# Altium schematic sheet BW1097_SODIMM.SchDoc: =project_title
size Tabloid; CompanyName: Luxonis Holding; Organization: Luxonis Holding; Address1: 1925 Harmony Park Drive; Address2: Westminster, CO; Address3: 80234; Address4: United States; SheetNumber: 9; SheetTotal: 17
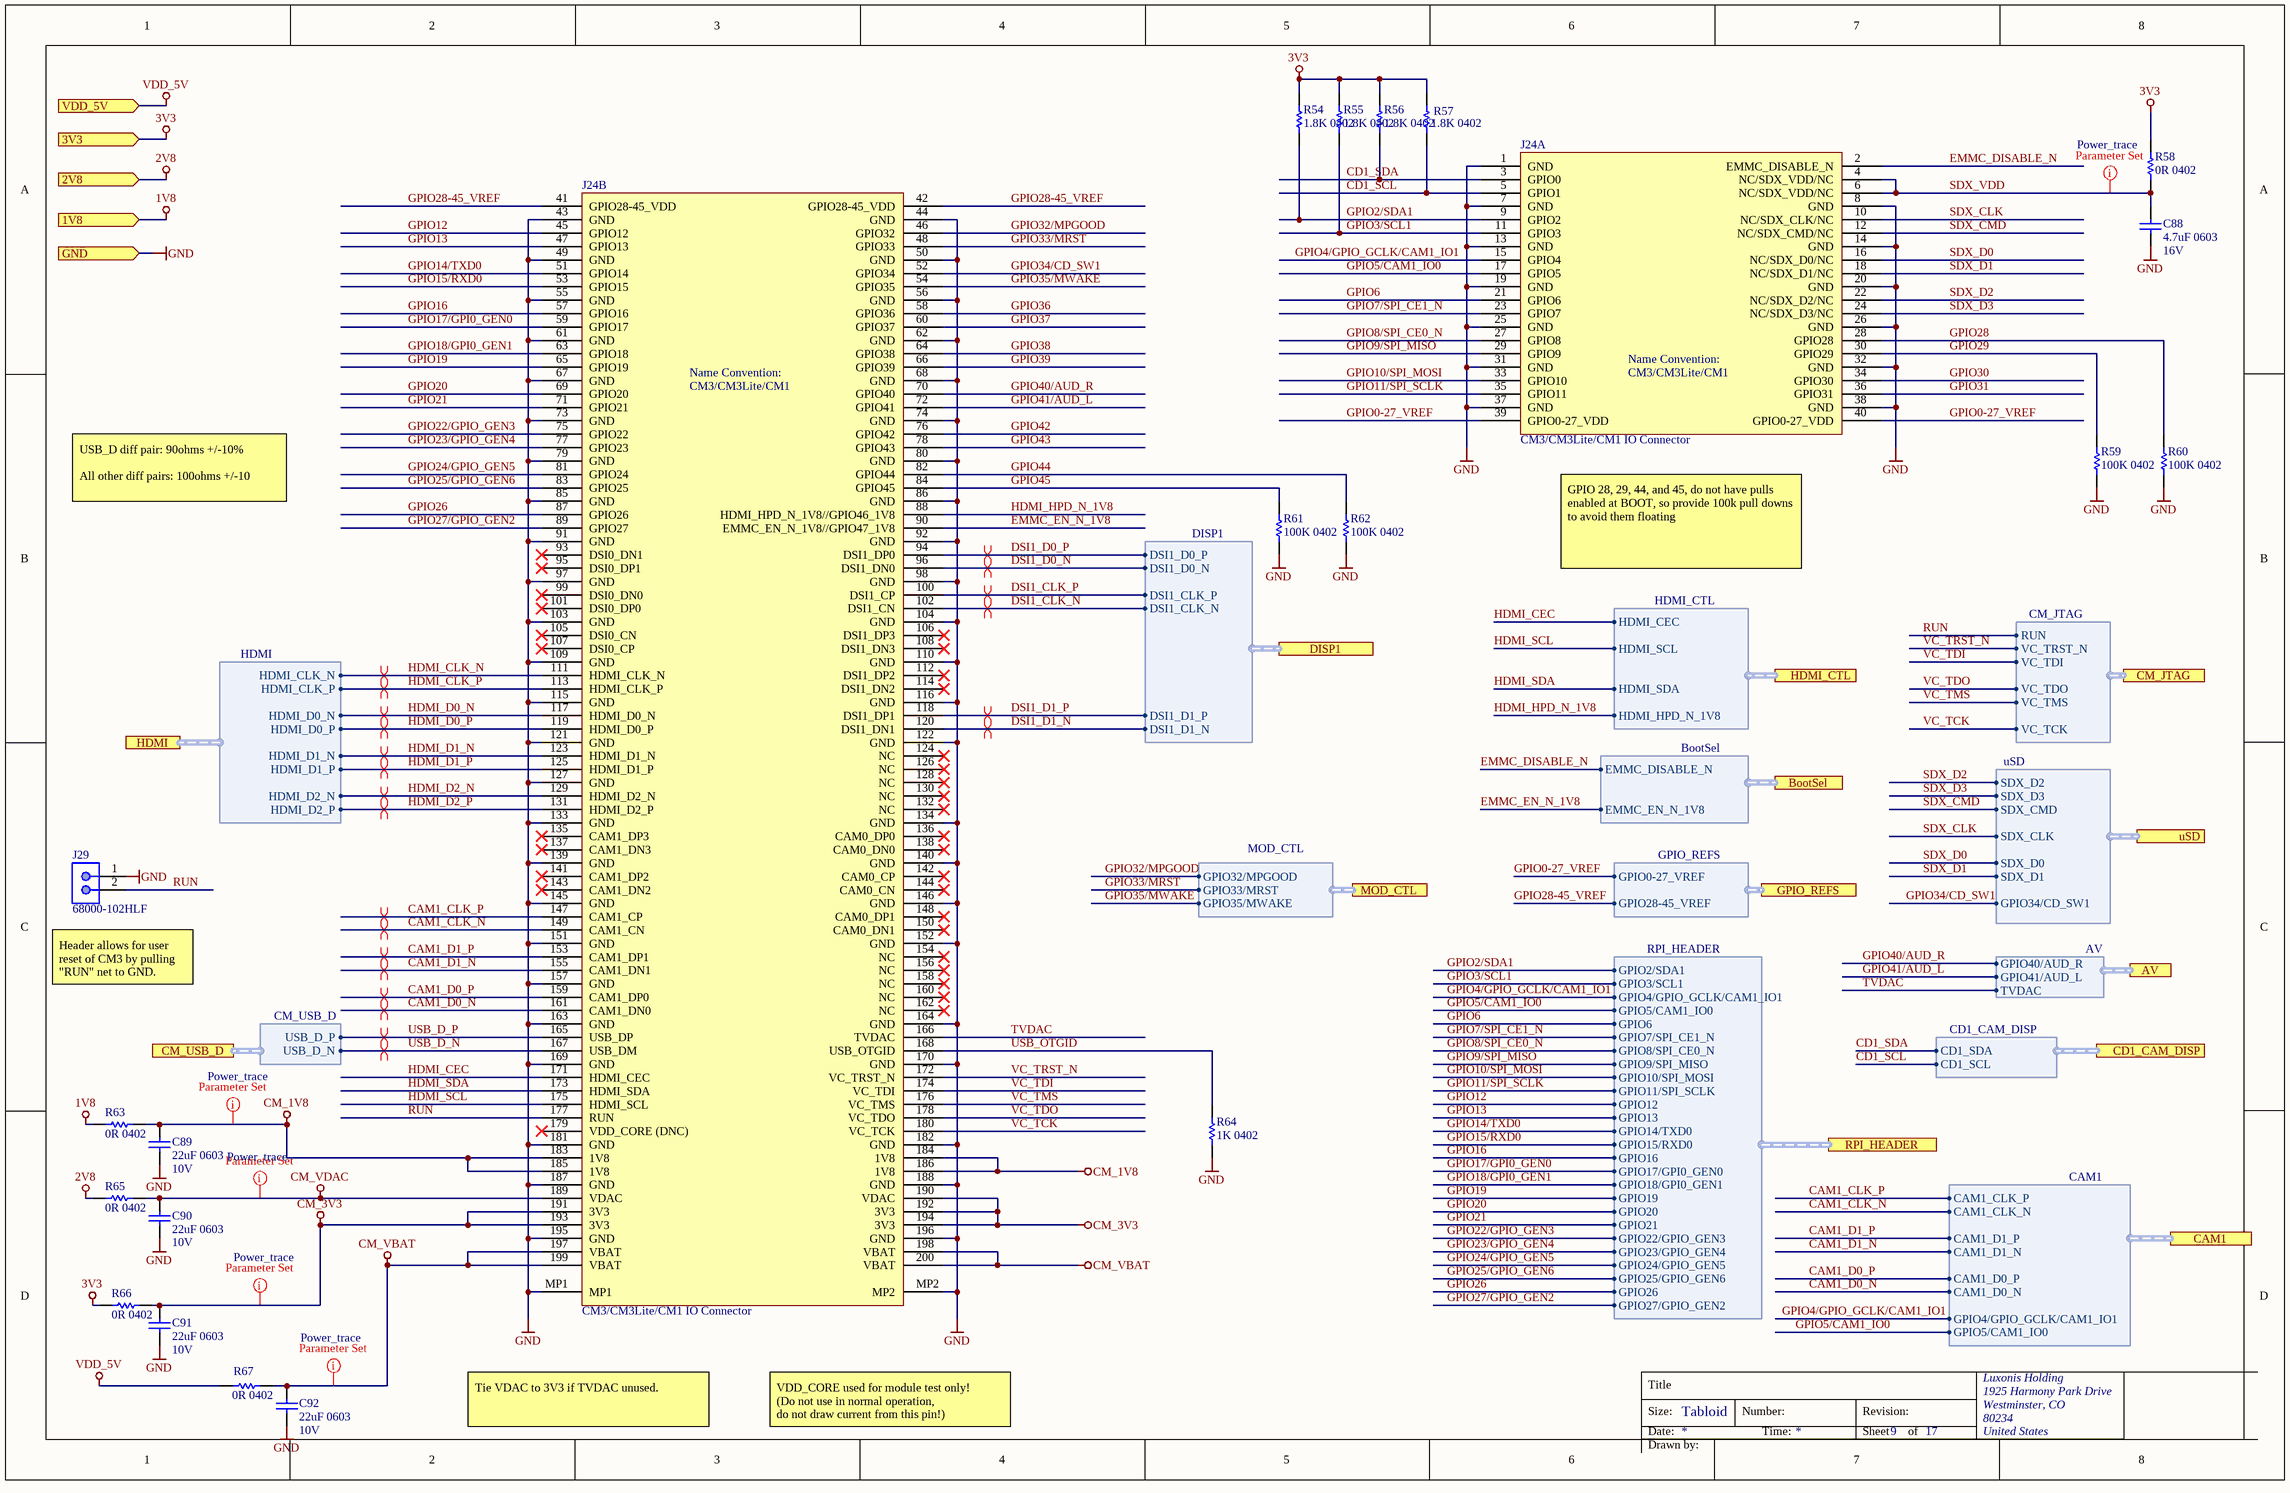
[diagram p0: BW1097_SODIMM.SchDoc]

## Parts
C88  4.7uF 0603  Voltage Rating: 16V  [CAPC0603(1608)100_N]
C89  22uF 0603  Voltage Rating: 10V  [CAPC0603(1608)100_N]
C90  22uF 0603  Voltage Rating: 10V  [CAPC0603(1608)100_N]
C91  22uF 0603  Voltage Rating: 10V  [CAPC0603(1608)100_N]
C92  22uF 0603  Voltage Rating: 10V  [CAPC0603(1608)100_N]
J24  CM3/CM3Lite/CM1 IO Connector  [1473005-4]  (parts A,B of 2)
J29  68000-102HLF  [68000-102HLF]
R54  1.8K 0402  [RESC0402(1005)_N]
R55  1.8K 0402  [RESC0402(1005)_N]
R56  1.8K 0402  [RESC0402(1005)_N]
R57  1.8K 0402  [RESC0402(1005)_N]
R58  0R 0402  [RESC0402(1005)_N]
R59  100K 0402  [RESC0402(1005)_N]
R60  100K 0402  [RESC0402(1005)_N]
R61  100K 0402  [RESC0402(1005)_N]
R62  100K 0402  [RESC0402(1005)_N]
R63  0R 0402  [RESC0402(1005)_N]
R64  1K 0402  [RESC0402(1005)_N]
R65  0R 0402  [RESC0402(1005)_N]
R66  0R 0402  [RESC0402(1005)_N]
R67  0R 0402  [RESC0402(1005)_N]

## Ports
1V8 (in), 2V8 (in), 3V3 (in), AV (harness AV), BootSel (harness BootSel), CAM1 (harness CAM1), CD1_CAM_DISP (harness CD1_CAM_DISP), CM_JTAG (harness CM_JTAG), CM_USB_D (harness CM_USB_D), DISP1 (harness DISP1), GND (in), GPIO_REFS (harness GPIO_REFS), HDMI (harness HDMI), HDMI_CTL (harness HDMI_CTL), MOD_CTL (harness MOD_CTL), RPI_HEADER (harness RPI_HEADER), uSD (harness uSD), VDD_5V (in)

## Harnesses
CM_JTAG: RUN, VC_TRST_N, VC_TDI, VC_TDO, VC_TMS, VC_TCK
uSD: SDX_D2, SDX_D3, SDX_CMD, SDX_CLK, SDX_D0, SDX_D1, GPIO34/CD_SW1
GPIO_REFS: GPIO0-27_VREF, GPIO28-45_VREF
BootSel: EMMC_DISABLE_N, EMMC_EN_N_1V8
HDMI: HDMI_CLK_N, HDMI_CLK_P, HDMI_D0_N, HDMI_D0_P, HDMI_D1_N, HDMI_D1_P, HDMI_D2_N, HDMI_D2_P
CM_USB_D: USB_D_P, USB_D_N
HDMI_CTL: HDMI_CEC, HDMI_SCL, HDMI_SDA, HDMI_HPD_N_1V8
RPI_HEADER: GPIO2/SDA1, GPIO3/SCL1, GPIO4/GPIO_GCLK/CAM1_IO1, GPIO5/CAM1_IO0, GPIO6, GPIO7/SPI_CE1_N, GPIO8/SPI_CE0_N, GPIO9/SPI_MISO, GPIO10/SPI_MOSI, GPIO12, GPIO13, GPIO14/TXD0, GPIO15/RXD0, GPIO16, GPIO17/GPI0_GEN0, GPIO18/GPI0_GEN1, GPIO19, GPIO20, GPIO21, GPIO22/GPIO_GEN3, GPIO23/GPIO_GEN4, GPIO24/GPIO_GEN5, GPIO25/GPIO_GEN6, GPIO26, GPIO27/GPIO_GEN2, GPIO11/SPI_SCLK
CD1_CAM_DISP: CD1_SCL, CD1_SDA
CAM1: CAM1_CLK_P, CAM1_CLK_N, CAM1_D1_P, CAM1_D1_N, CAM1_D0_P, CAM1_D0_N, GPIO4/GPIO_GCLK/CAM1_IO1, GPIO5/CAM1_IO0
DISP1: DSI1_D0_P, DSI1_D0_N, DSI1_CLK_P, DSI1_CLK_N, DSI1_D1_P, DSI1_D1_N
AV: GPIO40/AUD_R, GPIO41/AUD_L, TVDAC
MOD_CTL: GPIO32/MPGOOD, GPIO33/MRST, GPIO35/MWAKE

## Nets
1V8: R63.1 ; port 1V8
2V8: R65.1 ; port 2V8
3V3: R54.2 R55.2 R56.2 R57.2 R58.2 R66.1 ; port 3V3
CM_1V8: C89.1 J24.183(1V8) J24.184(1V8) J24.185(1V8) J24.186(1V8) R63.2
CM_3V3: C91.1 J24.190(VDAC) J24.191(3V3) J24.192(3V3) J24.193(3V3) J24.194(3V3) R66.2
CM_VBAT: C92.1 J24.197(VBAT) J24.198(VBAT) J24.199(VBAT) J24.200(VBAT) R67.2
CM_VDAC: C90.1 J24.189(VDAC) R65.2
GND: C88.1 C89.2 C90.2 C91.2 C92.2 J24.1(GND) J24.7(GND) J24.8(GND) J24.13(GND) J24.14(GND) J24.19(GND) J24.20(GND) J24.25(GND) J24.26(GND) J24.31(GND) J24.32(GND) J24.37(GND) J24.38(GND) J24.43(GND) J24.44(GND) J24.49(GND) J24.50(GND) J24.55(GND) J24.56(GND) J24.61(GND) J24.62(GND) J24.67(GND) J24.68(GND) J24.73(GND) J24.74(GND) J24.79(GND) J24.80(GND) J24.85(GND) J24.86(GND) J24.91(GND) J24.92(GND) J24.97(GND) J24.98(GND) J24.103(GND) J24.104(GND) J24.109(GND) J24.110(GND) J24.115(GND) J24.116(GND) J24.121(GND) J24.122(GND) J24.127(GND) J24.133(GND) J24.134(GND) J24.139(GND) J24.140(GND) J24.145(GND) J24.146(GND) J24.151(GND) J24.152(GND) J24.157(GND) J24.163(GND) J24.164(GND) J24.169(GND) J24.170(GND) J24.181(GND) J24.182(GND) J24.187(GND) J24.188(GND) J24.195(GND) J24.196(GND) J24.MP1 J24.MP2 J29.1 R59.1 R60.1 R61.1 R62.1 R64.1 ; port GND
VDD_5V: R67.1 ; port VDD_5V
CAM1_CLK_N: J24.149(CAM1_CN) ; port CAM1.CAM1_CLK_N
CAM1_CLK_P: J24.147(CAM1_CP) ; port CAM1.CAM1_CLK_P
CAM1_D0_N: J24.161(CAM1_DN0) ; port CAM1.CAM1_D0_N
CAM1_D0_P: J24.159(CAM1_DP0) ; port CAM1.CAM1_D0_P
CAM1_D1_N: J24.155(CAM1_DN1) ; port CAM1.CAM1_D1_N
CAM1_D1_P: J24.153(CAM1_DP1) ; port CAM1.CAM1_D1_P
CD1_SCL: J24.5(GPIO1) R57.1 ; port CD1_CAM_DISP.CD1_SCL
CD1_SDA: J24.3(GPIO0) R56.1 ; port CD1_CAM_DISP.CD1_SDA
DSI1_CLK_N: J24.102(DSI1_CN) ; port DISP1.DSI1_CLK_N
DSI1_CLK_P: J24.100(DSI1_CP) ; port DISP1.DSI1_CLK_P
DSI1_D0_N: J24.96(DSI1_DN0) ; port DISP1.DSI1_D0_N
DSI1_D0_P: J24.94(DSI1_DP0) ; port DISP1.DSI1_D0_P
DSI1_D1_N: J24.120(DSI1_DN1) ; port DISP1.DSI1_D1_N
DSI1_D1_P: J24.118(DSI1_DP1) ; port DISP1.DSI1_D1_P
EMMC_DISABLE_N: J24.2(EMMC_DISABLE_N) ; port BootSel.EMMC_DISABLE_N
EMMC_EN_N_1V8: J24.90(EMMC_EN_N_1V8//GPIO47_1V8) ; port BootSel.EMMC_EN_N_1V8
GPIO0-27_VREF: J24.39(GPIO0-27_VDD) J24.40(GPIO0-27_VDD) ; port GPIO_REFS.GPIO0-27_VREF
GPIO2/SDA1: J24.9(GPIO2) R54.1 ; port RPI_HEADER.GPIO2/SDA1
GPIO3/SCL1: J24.11(GPIO3) R55.1 ; port RPI_HEADER.GPIO3/SCL1
GPIO4/GPIO_GCLK/CAM1_IO1: J24.15(GPIO4) ; port RPI_HEADER.GPIO4/GPIO_GCLK/CAM1_IO1, port CAM1.GPIO4/GPIO_GCLK/CAM1_IO1
GPIO5/CAM1_IO0: J24.17(GPIO5) ; port RPI_HEADER.GPIO5/CAM1_IO0, port CAM1.GPIO5/CAM1_IO0
GPIO6: J24.21(GPIO6) ; port RPI_HEADER.GPIO6
GPIO7/SPI_CE1_N: J24.23(GPIO7) ; port RPI_HEADER.GPIO7/SPI_CE1_N
GPIO8/SPI_CE0_N: J24.27(GPIO8) ; port RPI_HEADER.GPIO8/SPI_CE0_N
GPIO9/SPI_MISO: J24.29(GPIO9) ; port RPI_HEADER.GPIO9/SPI_MISO
GPIO10/SPI_MOSI: J24.33(GPIO10) ; port RPI_HEADER.GPIO10/SPI_MOSI
GPIO11/SPI_SCLK: J24.35(GPIO11) ; port RPI_HEADER.GPIO11/SPI_SCLK
GPIO12: J24.45(GPIO12) ; port RPI_HEADER.GPIO12
GPIO13: J24.47(GPIO13) ; port RPI_HEADER.GPIO13
GPIO14/TXD0: J24.51(GPIO14) ; port RPI_HEADER.GPIO14/TXD0
GPIO15/RXD0: J24.53(GPIO15) ; port RPI_HEADER.GPIO15/RXD0
GPIO16: J24.57(GPIO16) ; port RPI_HEADER.GPIO16
GPIO17/GPI0_GEN0: J24.59(GPIO17) ; port RPI_HEADER.GPIO17/GPI0_GEN0
GPIO18/GPI0_GEN1: J24.63(GPIO18) ; port RPI_HEADER.GPIO18/GPI0_GEN1
GPIO19: J24.65(GPIO19) ; port RPI_HEADER.GPIO19
GPIO20: J24.69(GPIO20) ; port RPI_HEADER.GPIO20
GPIO21: J24.71(GPIO21) ; port RPI_HEADER.GPIO21
GPIO22/GPIO_GEN3: J24.75(GPIO22) ; port RPI_HEADER.GPIO22/GPIO_GEN3
GPIO23/GPIO_GEN4: J24.77(GPIO23) ; port RPI_HEADER.GPIO23/GPIO_GEN4
GPIO24/GPIO_GEN5: J24.81(GPIO24) ; port RPI_HEADER.GPIO24/GPIO_GEN5
GPIO25/GPIO_GEN6: J24.83(GPIO25) ; port RPI_HEADER.GPIO25/GPIO_GEN6
GPIO26: J24.87(GPIO26) ; port RPI_HEADER.GPIO26
GPIO27/GPIO_GEN2: J24.89(GPIO27) ; port RPI_HEADER.GPIO27/GPIO_GEN2
GPIO28: J24.28(GPIO28) R60.2
GPIO28-45_VREF: J24.41(GPIO28-45_VDD) J24.42(GPIO28-45_VDD) ; port GPIO_REFS.GPIO28-45_VREF
GPIO29: J24.30(GPIO29) R59.2
GPIO30: J24.34(GPIO30)
GPIO31: J24.36(GPIO31)
GPIO32/MPGOOD: J24.46(GPIO32) ; port MOD_CTL.GPIO32/MPGOOD
GPIO33/MRST: J24.48(GPIO33) ; port MOD_CTL.GPIO33/MRST
GPIO34/CD_SW1: J24.52(GPIO34) ; port uSD.GPIO34/CD_SW1
GPIO35/MWAKE: J24.54(GPIO35) ; port MOD_CTL.GPIO35/MWAKE
GPIO36: J24.58(GPIO36)
GPIO37: J24.60(GPIO37)
GPIO38: J24.64(GPIO38)
GPIO39: J24.66(GPIO39)
GPIO40/AUD_R: J24.70(GPIO40) ; port AV.GPIO40/AUD_R
GPIO41/AUD_L: J24.72(GPIO41) ; port AV.GPIO41/AUD_L
GPIO42: J24.76(GPIO42)
GPIO43: J24.78(GPIO43)
GPIO44: J24.82(GPIO44) R62.2
GPIO45: J24.84(GPIO45) R61.2
HDMI_CEC: J24.171(HDMI_CEC) ; port HDMI_CTL.HDMI_CEC
HDMI_CLK_N: J24.111(HDMI_CLK_N) ; port HDMI.HDMI_CLK_N
HDMI_CLK_P: J24.113(HDMI_CLK_P) ; port HDMI.HDMI_CLK_P
HDMI_D0_N: J24.117(HDMI_D0_N) ; port HDMI.HDMI_D0_N
HDMI_D0_P: J24.119(HDMI_D0_P) ; port HDMI.HDMI_D0_P
HDMI_D1_N: J24.123(HDMI_D1_N) ; port HDMI.HDMI_D1_N
HDMI_D1_P: J24.125(HDMI_D1_P) ; port HDMI.HDMI_D1_P
HDMI_D2_N: J24.129(HDMI_D2_N) ; port HDMI.HDMI_D2_N
HDMI_D2_P: J24.131(HDMI_D2_P) ; port HDMI.HDMI_D2_P
HDMI_HPD_N_1V8: J24.88(HDMI_HPD_N_1V8//GPIO46_1V8) ; port HDMI_CTL.HDMI_HPD_N_1V8
HDMI_SCL: J24.175(HDMI_SCL) ; port HDMI_CTL.HDMI_SCL
HDMI_SDA: J24.173(HDMI_SDA) ; port HDMI_CTL.HDMI_SDA
RUN: J24.177(RUN) J29.2 ; port CM_JTAG.RUN
SDX_CLK: J24.10(NC/SDX_CLK/NC) ; port uSD.SDX_CLK
SDX_CMD: J24.12(NC/SDX_CMD/NC) ; port uSD.SDX_CMD
SDX_D0: J24.16(NC/SDX_D0/NC) ; port uSD.SDX_D0
SDX_D1: J24.18(NC/SDX_D1/NC) ; port uSD.SDX_D1
SDX_D2: J24.22(NC/SDX_D2/NC) ; port uSD.SDX_D2
SDX_D3: J24.24(NC/SDX_D3/NC) ; port uSD.SDX_D3
SDX_VDD: C88.2 J24.4(NC/SDX_VDD/NC) J24.6(NC/SDX_VDD/NC) R58.1
TVDAC: J24.166(TVDAC) ; port AV.TVDAC
USB_D_N: J24.167(USB_DM) ; port CM_USB_D.USB_D_N
USB_D_P: J24.165(USB_DP) ; port CM_USB_D.USB_D_P
USB_OTGID: J24.168(USB_OTGID) R64.2
VC_TCK: J24.180(VC_TCK) ; port CM_JTAG.VC_TCK
VC_TDI: J24.174(VC_TDI) ; port CM_JTAG.VC_TDI
VC_TDO: J24.178(VC_TDO) ; port CM_JTAG.VC_TDO
VC_TMS: J24.176(VC_TMS) ; port CM_JTAG.VC_TMS
VC_TRST_N: J24.172(VC_TRST_N) ; port CM_JTAG.VC_TRST_N

Not connected (* = marked no-connect by the designer): J24 93(DSI0_DN1)* 95(DSI0_DP1)* 99(DSI0_DN0)* 101(DSI0_DP0)* 105(DSI0_CN)* 106(DSI1_DP3)* 107(DSI0_CP)* 108(DSI1_DN3)* 112(DSI1_DP2)* 114(DSI1_DN2)* 124(NC)* 126(NC)* 128(NC)* 130(NC)* 132(NC)* 135(CAM1_DP3)* 136(CAM0_DP0)* 137(CAM1_DN3)* 138(CAM0_DN0)* 141(CAM1_DP2)* 142(CAM0_CP)* 143(CAM1_DN2)* 144(CAM0_CN)* 148(CAM0_DP1)* 150(CAM0_DN1)* 154(NC)* 156(NC)* 158(NC)* 160(NC)* 162(NC)* 179(VDD_CORE_(DNC))*

## Layout directives
differential pair; differential pair class 100ohm: CAM1_CLK_N, CAM1_CLK_P, CAM1_D0_N, CAM1_D0_P, CAM1_D1_N, CAM1_D1_P, DSI1_CLK_N, DSI1_CLK_P, DSI1_D0_N, DSI1_D0_P, DSI1_D1_N, DSI1_D1_P, HDMI_CLK_N, HDMI_CLK_P, HDMI_D0_N, HDMI_D0_P, HDMI_D1_N, HDMI_D1_P, HDMI_D2_N, HDMI_D2_P
net class Power_trace: CM_1V8, CM_3V3, CM_VBAT, CM_VDAC, SDX_VDD
differential pair; differential pair class 90ohm: USB_D_N, USB_D_P

## Notes on the sheet
- USB_D diff pair: 90ohms +/-10%
  All other diff pairs: 100ohms +/-10
- GPIO 28, 29, 44, and 45, do not have pulls enabled at BOOT, so provide 100k pull downs to avoid them floating
- (near J29) Header allows for user reset of CM3 by pulling "RUN" net to GND.
- Tie VDAC to 3V3 if TVDAC unused.
- VDD_CORE used for module test only!
  (Do not use in normal operation,
  do not draw current from this pin!)
- Title
- Size:
- Date:
- Tabloid
- Number:
- Time:
- Revision:
- Sheet
- of
- Drawn by:
- (in symbol 1473005-4_ComputeModule, part A) Name Convention:; CM3/CM3Lite/CM1
- (in symbol 1473005-4_ComputeModule, part B) Name Convention:; CM3/CM3Lite/CM1

## Library data of the parts
C88 = GRM188R61C475KAAJD: CAP CER 4.7UF 16V X5R 0603 10%; Manufacturer 1: Murata; Material: Ceramic; Manufacturer Part Number 1: GRM188R61C475KAAJD; Supplier 1: Digi-Key; Stock 1: 455058; Pricing 1: 1=0.35000, 10=0.24600, 100=0.14730, 500=0.11050, 1000=0.09331 (USD); RoHS: Yes; Mount: Surface Mount; Case/Package: 0603; Weight: 0.000222oz; Case Code (Metric): 1608; Case Code (Imperial): 0603; Min Operating Temperature: -55°C; Max Operating Temperature: 85°C; Capacitance: 4.7uF; Tolerance: 10%; Packaging: Tape and Reel; Dielectric: X5R; Termination: SMD/SMT; Voltage Rating (DC): 16V; Package Quantity: 4000; Length: 1.6mm; Height: 0.8mm; Width: 0.8mm; Thickness: 0.037inch; Depth: 0.8mm; REACH SVHC: No SVHC; Lead Free: Lead Free; ComponentLink1URL: https://datasheet.ciiva.com/14813/595grm188r61c475kaaj23-14813668.pdf?src-supplier=Arrow; ComponentLink1Description: https://datasheet.ciiva.com/14813/595grm188r61c475kaaj23-14813668.pdf?src-supplier=Arrow; Supplier 2: Digi-Key; Manufacturer 2: Murata; Manufacturer Part Number 2: GRM188R61C475KAAJD; Stock 2: 455058; Pricing 2: 1=0.35000, 10=0.24600, 100=0.14730, 500=0.11050, 1000=0.09331 (USD); Supplier 3: Digi-Key; Manufacturer 3: Murata; Manufacturer Part Number 3: GRM188R61C475KAAJD; Stock 3: 452000; Pricing 3: 4000=0.07259, 8000=0.06832, 12000=0.06619, 28000=0.06405 (USD); Supplier Part Number 1: 490-10481-1-ND; Supplier Part Number 2: 490-10481-6-ND; Supplier Part Number 3: 490-10481-2-ND
C89-C92 = GRM188R61A226ME15D: CAP CER 22UF 10V X5R 0603 20%; Manufacturer 1: Murata; Material: Ceramic; Manufacturer Part Number 1: GRM188R61A226ME15D; ComponentLink1URL: https://datasheet.ciiva.com/46444/1769893-46444975.pdf?src-supplier=Element14; ComponentLink1Description: https://datasheet.ciiva.com/46444/1769893-46444975.pdf?src-supplier=Element14; Supplier 1: Digi-Key; Stock 1: 984716; Pricing 1: 1=0.31000, 10=0.21500, 100=0.12160, 500=0.08584, 1000=0.07512 (USD); RoHS: Yes; Mount: Surface Mount; Case/Package: 0603; Weight: 0.000222oz; Case Code (Metric): 1608; Case Code (Imperial): 0603; Min Operating Temperature: -55°C; Max Operating Temperature: 85°C; Capacitance: 22uF; Tolerance: 20%; Packaging: Tape and Reel; Dielectric: X5R; Voltage Rating (DC): 10V; Termination: SMD/SMT; Package Quantity: 4000; Length: 1.6mm; Height: 0.8mm; Width: 0.8mm; Thickness: 0.039inch; Depth: 0.8mm; REACH SVHC: No SVHC; Lead Free: Lead Free; Supplier Part Number 1: 490-10476-1-ND
J24 = 1473005-4_ComputeModule: CONN SKT SODIMM 200POS R/A SMD CM3/CM3Lite/CM1 IO Connector; Manufacturer 1: AMP - TE CONNECTIVITY; Number of Contacts: 200; Voltage Rating: 1.8V; Memory Type: SDRAM,DDR; PCB Mount Retention: With; Insulation Resistance: 250MR; Contact Current Rating: 500mA; Circuit Application: Power; Connector System: Cable-to-Board; Sealable: No (Without); Gender: Female; Connector Type: Socket; Pitch: 0.6mm; Row Spacing: 0.244inch; Stack Height: 5.2mm; Manufacturer Part Number 1: 1473005-4; Supplier 1: Digi-Key; Stock 1: 9819; Pricing 1: 1=4.23000, 10=4.06500, 25=3.72640, 50=3.55700, 100=3.38760, 250=2.96416, 500=2.87946, 1000=2.45601, 2500=2.28663 (USD); RoHS: Yes; Mount: Surface Mount; Number of Pins: 200; Contact Material: Copper Alloy; Contact Plating: Gold; Housing Color: Black; Housing Material: Thermoplastic; Insulation Material: Thermoplastic; Min Operating Temperature: -67°C; Max Operating Temperature: 185°C; Number of Rows: 2; Orientation: Right Angle; Termination: Solder; Packaging: Tray; Package Quantity: 20; Number of Positions: 200; Length: 71.5mm; Depth: 26mm; Radiation Hardening: No; ELV: Compliant; Flammability Rating: UL94 V-0; Lead Free: Lead Free; REACH SVHC: No SVHC; ComponentLink1URL: https://datasheet.ciiva.com/682/eng-cd-1473005-j2-682720.pdf?src-supplier=Farnell; ComponentLink1Description: https://datasheet.ciiva.com/682/eng-cd-1473005-j2-682720.pdf?src-supplier=Farnell; ComponentLink2URL: https://datasheet.ciiva.com/15171/getdatasheetpartid-99150-15171488.pdf?src-supplier=Verical; ComponentLink2Description: https://datasheet.ciiva.com/15171/getdatasheetpartid-99150-15171488.pdf?src-supplier=Verical; ComponentLink3URL: https://datasheet.ciiva.com/1105/582309-1105221.pdf?src-supplier=Element14; ComponentLink3Description: https://datasheet.ciiva.com/1105/582309-1105221.pdf?src-supplier=Element14; ComponentLink4URL: https://datasheet.ciiva.com/682/eng-cd-1473005-j2-682726.pdf?src-supplier=Digi-Key; ComponentLink4Description: https://datasheet.ciiva.com/682/eng-cd-1473005-j2-682726.pdf?src-supplier=Digi-Key; ComponentLink5URL: https://datasheet.ciiva.com/14156/04821302-14156311.pdf?src-supplier=Distrelec; ComponentLink5Description: https://datasheet.ciiva.com/14156/04821302-14156311.pdf?src-supplier=Distrelec; ComponentLink6URL: https://datasheet.ciiva.com/3136/eng-cd-1473005-j-3136060.pdf?src-supplier=Avnet; ComponentLink6Description: https://datasheet.ciiva.com/3136/eng-cd-1473005-j-3136060.pdf?src-supplier=Avnet; ComponentLink7URL: https://datasheet.ciiva.com/16380/eng-cd-1473005-j-16380909.pdf?src-supplier=Future+Electronics; ComponentLink7Description: https://datasheet.ciiva.com/16380/eng-cd-1473005-j-16380909.pdf?src-supplier=Future+Electronics; ComponentLink8URL: https://datasheet.ciiva.com/16651/eng-cd-1473005-j-16651646.pdf?src-supplier=Avnet+Europe; ComponentLink8Description: https://datasheet.ciiva.com/16651/eng-cd-1473005-j-16651646.pdf?src-supplier=Avnet+Europe; ComponentLink9URL: http://www.farnell.com/datasheets/582309.pdf?src-supplier=Farnell; ComponentLink9Description: http://www.farnell.com/datasheets/582309.pdf?src-supplier=Farnell; Supplier Part Number 1: A114851-ND; Supplier 2: Avnet; Supplier 3: Newark; Supplier 4: Mouser; Supplier Part Number 2: 1473005-4; Supplier Part Number 3: 22K8810; Supplier Part Number 4: 571-1473005-4
J29 = 68000-102HLF: CONN HEADER VERT 2POS 2.54MM; Manufacturer 1: Amphenol FCI; Number of Contacts: 2; Connector Type: Male Pin; Current Rating: 3A; Gender: Male; Voltage Rating: 1.5kV; Insulation Resistance: 5GR; Contact Post Length: 2.41mm; Supplier 1: Digi-Key; Manufacturer Part Number 1: 68000-102HLF; Stock 1: 23525; Pricing 1: 1=0.20000, 10=0.19000, 100=0.13180, 500=0.11154, 1000=0.09126, 5000=0.08112, 10000=0.07352 (USD); RoHS: Yes; Mount: Through Hole; Contact Material: Bronze; Contact Plating: Gold,GXT; Color: Black; Housing Material: Thermoplastic; Housing Color: Black; Min Operating Temperature: -65°C; Max Operating Temperature: 125°C; Number of Rows: 1; Termination: Solder; Packaging: Bulk; Number of Positions: 2; Orientation: Straight; Package Quantity: 100; Contact Gender: Male; Max Voltage Rating (AC): 1.5kV; Voltage Rating (DC): 1.5kV; Length: 5.08mm; Pitch: 2.54mm; Contact Mating Length: 0.23inch; Depth: 2.41mm; Radiation Hardening: No; Lead Free: Lead Free; Flammability Rating: UL94 V-0; ComponentLink1URL: https://datasheet.ciiva.com/5149/68000-274228-5149165.pdf?src-supplier=Mouser; ComponentLink1Description: https://datasheet.ciiva.com/5149/68000-274228-5149165.pdf?src-supplier=Mouser; ComponentLink2URL: https://datasheet.ciiva.com/722/68000-722084.pdf?src-supplier=Digi-Key; ComponentLink2Description: https://datasheet.ciiva.com/722/68000-722084.pdf?src-supplier=Digi-Key; ComponentLink3URL: https://datasheet.ciiva.com/16726/68000-16726309.pdf?src-supplier=Avnet+Europe; ComponentLink3Description: https://datasheet.ciiva.com/16726/68000-16726309.pdf?src-supplier=Avnet+Europe; ComponentLink4URL: https://datasheet.ciiva.com/10149/68000-10149324.pdf?src-supplier=Avnet; ComponentLink4Description: https://datasheet.ciiva.com/10149/68000-10149324.pdf?src-supplier=Avnet; Supplier Part Number 1: 609-3500-ND
R54-R57 = RC0402FR-071K8L: RES SMD 1.8K OHM 1% 1/16W 0402; Manufacturer 1: Yageo; Resistance: 1.8kR; Temperature Coefficient: 100ppm/°C; Power Rating: 63mW; Voltage Rating: 50V; Manufacturer Part Number 1: RC0402FR-071K8L; Supplier 1: Digi-Key; Stock 1: 1041820; Pricing 1: 1=0.10000, 10=0.01600, 100=0.00640, 1000=0.00289, 2500=0.00251, 5000=0.00207 (USD); RoHS: Yes; Case/Package: 0402; Case Code (Imperial): 0402; Case Code (Metric): 1005; Min Operating Temperature: -55°C; Max Operating Temperature: 155°C; Tolerance: 1%; Packaging: Tape and Reel; Composition: Thick Film; Package Quantity: 1; Termination: SMD/SMT; Number of Terminations: 2; Max Power Dissipation: 63mW; Military Standard: Not; Features: Moisture Resistant; Working Voltage: 50V; Length: 1mm; Height: 0.016inch; Width: 0.02inch; Depth: 0.5mm; Lead Free: Lead Free; REACH SVHC: Unknown; ComponentLink1URL: https://datasheet.ciiva.com/11819/0900766b80c66297-11819472.pdf?src-supplier=RSComponents; ComponentLink1Description: https://datasheet.ciiva.com/11819/0900766b80c66297-11819472.pdf?src-supplier=RSComponents; ComponentLink2URL: https://datasheet.ciiva.com/2453/pyu-r-int-thick-7-2453530.pdf?src-supplier=Digi-Key; ComponentLink2Description: https://datasheet.ciiva.com/2453/pyu-r-int-thick-7-2453530.pdf?src-supplier=Digi-Key; ComponentLink3URL: https://datasheet.ciiva.com/7849/1018594-7849868.pdf?src-supplier=Element14; ComponentLink3Description: https://datasheet.ciiva.com/7849/1018594-7849868.pdf?src-supplier=Element14; ComponentLink4URL: https://datasheet.ciiva.com/16744/pyu-rc0402-51-rohs-l-6-r-16744223.pdf?src-supplier=Future+Electronics; ComponentLink4Description: https://datasheet.ciiva.com/16744/pyu-rc0402-51-rohs-l-6-r-16744223.pdf?src-supplier=Future+Electronics; ComponentLink5URL: https://datasheet.ciiva.com/7849/1018594-7849867.pdf?src-supplier=Element14; ComponentLink5Description: https://datasheet.ciiva.com/7849/1018594-7849867.pdf?src-supplier=Element14; ComponentLink6URL: https://datasheet.ciiva.com/12667/pyu-rc0402-51-rohs-l-6-r-12667431.pdf?src-supplier=Mouser; ComponentLink6Description: https://datasheet.ciiva.com/12667/pyu-rc0402-51-rohs-l-6-r-12667431.pdf?src-supplier=Mouser; ComponentLink7URL: https://datasheet.ciiva.com/2453/pyu-r-int-thick-7-2453529.pdf?src-supplier=Digi-Key; ComponentLink7Description: https://datasheet.ciiva.com/2453/pyu-r-int-thick-7-2453529.pdf?src-supplier=Digi-Key; ComponentLink8URL: https://datasheet.ciiva.com/2453/pyu-r-int-thick-7-2453531.pdf?src-supplier=Digi-Key; ComponentLink8Description: https://datasheet.ciiva.com/2453/pyu-r-int-thick-7-2453531.pdf?src-supplier=Digi-Key; Supplier 2: Mouser; Supplier Part Number 2: 603-RC0402FR-071K8L; Supplier Part Number 1: 311-1.80KLRCT-ND
R58 R63 R65-R67 = CRCW04020000Z0ED: RES SMD 0 OHM JUMPER 1/16W 0402; Manufacturer 1: Vishay; Resistance: 0mR; Power Rating: 63mW; Voltage Rating: 50V; Temperature Coefficient: 100ppm/°C; Tolerance: 5%; Manufacturer Part Number 1: CRCW04020000Z0ED; Supplier 1: Digi-Key; Stock 1: 855968; Pricing 1: 1=0.10000, 10=0.03400, 25=0.02440, 50=0.01860, 100=0.01380, 250=0.01048, 500=0.00840, 1000=0.00618, 5000=0.00443 (USD); RoHS: Yes; Mount: Surface Mount; Case/Package: 0402; Weight: 2.3E-05oz; Case Code (Imperial): 0402; Case Code (Metric): 1005; Contact Plating: Tin; Min Operating Temperature: -55°C; Max Operating Temperature: 155°C; Packaging: Tape and Reel; Composition: Thick Film; Voltage Rating (DC): 50V; Package Quantity: 1; Termination: SMD/SMT; Number of Terminations: 2; Military Standard: Not; Max Power Dissipation: 63mW; Features: Automotive AEC-Q200; Length: 1mm; Height: 0.35mm; Width: 0.5mm; Depth: 0.5mm; Radiation Hardening: No; REACH SVHC: Unknown; Lead Free: Lead Free; ComponentLink1URL: https://datasheet.ciiva.com/3255/dcrcwe3-3255944.pdf?src-supplier=Avnet; ComponentLink1Description: https://datasheet.ciiva.com/3255/dcrcwe3-3255944.pdf?src-supplier=Avnet; ComponentLink2URL: https://datasheet.ciiva.com/3255/dcrcwe3-3255945.pdf?src-supplier=Avnet; ComponentLink2Description: https://datasheet.ciiva.com/3255/dcrcwe3-3255945.pdf?src-supplier=Avnet; ComponentLink3URL: https://datasheet.ciiva.com/16881/dcrcwe3-16881413.pdf?src-supplier=Avnet+Europe; ComponentLink3Description: https://datasheet.ciiva.com/16881/dcrcwe3-16881413.pdf?src-supplier=Avnet+Europe; ComponentLink4URL: https://datasheet.ciiva.com/2461/dcrcwe3-2461962.pdf?src-supplier=Digi-Key; ComponentLink4Description: https://datasheet.ciiva.com/2461/dcrcwe3-2461962.pdf?src-supplier=Digi-Key; ComponentLink5URL: https://datasheet.ciiva.com/7841/1720486-7841802.pdf?src-supplier=Element14; ComponentLink5Description: https://datasheet.ciiva.com/7841/1720486-7841802.pdf?src-supplier=Element14; ComponentLink6URL: https://datasheet.ciiva.com/2461/dcrcwe3-2461963.pdf?src-supplier=Digi-Key; ComponentLink6Description: https://datasheet.ciiva.com/2461/dcrcwe3-2461963.pdf?src-supplier=Digi-Key; ComponentLink7URL: https://datasheet.ciiva.com/2461/dcrcwe3-2461964.pdf?src-supplier=Digi-Key; ComponentLink7Description: https://datasheet.ciiva.com/2461/dcrcwe3-2461964.pdf?src-supplier=Digi-Key; ComponentLink8URL: https://datasheet.ciiva.com/7841/1697337-7841468.pdf?src-supplier=Element14; ComponentLink8Description: https://datasheet.ciiva.com/7841/1697337-7841468.pdf?src-supplier=Element14; ComponentLink9URL: https://datasheet.ciiva.com/16761/70200976-16761309.pdf?src-supplier=Allied+Electronics; ComponentLink9Description: https://datasheet.ciiva.com/16761/70200976-16761309.pdf?src-supplier=Allied+Electronics; ComponentLink10URL: https://datasheet.ciiva.com/26311/fld-crcw-e3-data-en-26311550.pdf?src-supplier=Distrelec; ComponentLink10Description: https://datasheet.ciiva.com/26311/fld-crcw-e3-data-en-26311550.pdf?src-supplier=Distrelec; Supplier Part Number 1: 541-0.0JCT-ND
R59-R62 = RC0402FR-07100KL: RES SMD 100K OHM 1% 1/16W 0402; Manufacturer 1: Yageo; Resistance: 100kR; Temperature Coefficient: 100ppm/°C; Power Rating: 63mW; Voltage Rating: 50V; Manufacturer Part Number 1: RC0402FR-07100KL; Supplier 1: Digi-Key; Stock 1: 50867324; Pricing 1: 1=0.10000, 10=0.01500, 100=0.00600, 1000=0.00270, 2500=0.00235, 5000=0.00194 (USD); RoHS: Yes; Case Code (Imperial): 0402; Case Code (Metric): 1005; Min Operating Temperature: -55°C; Max Operating Temperature: 155°C; Packaging: Tape and Reel; Composition: Thick Film; Termination: SMD/SMT; Military Standard: Not; Number of Terminations: 2; Working Voltage: 50V; Length: 0.039inch; Height: 0.016inch; Width: 0.02inch; Depth: 0.5mm; Lead Free: Lead Free; REACH SVHC: No SVHC; ComponentLink1URL: https://datasheet.ciiva.com/11819/0900766b80c66297-11819452.pdf?src-supplier=RSComponents; ComponentLink1Description: https://datasheet.ciiva.com/11819/0900766b80c66297-11819452.pdf?src-supplier=RSComponents; ComponentLink2URL: https://datasheet.ciiva.com/2453/pyu-r-int-thick-7-2453361.pdf?src-supplier=Digi-Key; ComponentLink2Description: https://datasheet.ciiva.com/2453/pyu-r-int-thick-7-2453361.pdf?src-supplier=Digi-Key; ComponentLink3URL: https://datasheet.ciiva.com/2453/pyu-r-int-thick-7-2453362.pdf?src-supplier=Digi-Key; ComponentLink3Description: https://datasheet.ciiva.com/2453/pyu-r-int-thick-7-2453362.pdf?src-supplier=Digi-Key; ComponentLink4URL: https://datasheet.ciiva.com/2453/pyu-r-int-thick-7-2453363.pdf?src-supplier=Digi-Key; ComponentLink4Description: https://datasheet.ciiva.com/2453/pyu-r-int-thick-7-2453363.pdf?src-supplier=Digi-Key; ComponentLink5URL: https://datasheet.ciiva.com/22747/1018594-22747509.pdf?src-supplier=Element14; ComponentLink5Description: https://datasheet.ciiva.com/22747/1018594-22747509.pdf?src-supplier=Element14; ComponentLink6URL: https://datasheet.ciiva.com/15189/getdatasheetpartid-323696-15189334.pdf?src-supplier=Verical; ComponentLink6Description: https://datasheet.ciiva.com/15189/getdatasheetpartid-323696-15189334.pdf?src-supplier=Verical; Supplier Part Number 1: 311-100KLRCT-ND; Case/Package: 0402; Tolerance: 1%; Package Quantity: 1; Max Power Dissipation: 63mW; Features: Moisture Resistant; ComponentLink7URL: https://datasheet.ciiva.com/12667/pyu-rc0402-51-rohs-l-6-r-12667930.pdf?src-supplier=Mouser; ComponentLink7Description: https://datasheet.ciiva.com/12667/pyu-rc0402-51-rohs-l-6-r-12667930.pdf?src-supplier=Mouser; Supplier 2: Newark; Supplier 3: Mouser; Supplier Part Number 2: 67R9887; Supplier Part Number 3: 603-RC0402FR-07100KL
R64 = RC0402FR-071KL: RES SMD 1K OHM 1% 1/16W 0402 1 kOhms ±1% 0.063W, 1/16W Chip Resistor 0402 (1005 Metric) Moisture Resistant Thick Film; Manufacturer 1: Yageo; Temperature Coefficient: 100ppm/°C; Power Rating: 62.5mW; Voltage Rating (DC): 50V; Resistance: 1kR; Manufacturer Part Number 1: RC0402FR-071KL; RoHS: Yes; Number of Pins: 2; Case Code (Imperial): 0402; Case Code (Metric): 1005; Min Operating Temperature: -55°C; Max Operating Temperature: 155°C; Packaging: Tape and Reel; Composition: Thick Film; Voltage Rating: 50V; Military Standard: Not; Termination: SMD/SMT; Length: 1mm; Height: 0.32mm; Width: 0.5mm; Depth: 0.5mm; Lead Free: Lead Free; REACH SVHC: Unknown; ComponentLink1URL: https://datasheet.ciiva.com/11819/0900766b80c66297-11819477.pdf?src-supplier=RSComponents; ComponentLink1Description: https://datasheet.ciiva.com/11819/0900766b80c66297-11819477.pdf?src-supplier=RSComponents; ComponentLink2URL: https://datasheet.ciiva.com/12666/pyu-rc0402-51-rohs-l-6-r-12666741.pdf?src-supplier=Mouser; ComponentLink2Description: https://datasheet.ciiva.com/12666/pyu-rc0402-51-rohs-l-6-r-12666741.pdf?src-supplier=Mouser; ComponentLink3URL: https://datasheet.ciiva.com/17063/pyu-rc0402-51-rohs-l-6-r-17063193.pdf?src-supplier=Future+Electronics; ComponentLink3Description: https://datasheet.ciiva.com/17063/pyu-rc0402-51-rohs-l-6-r-17063193.pdf?src-supplier=Future+Electronics; ComponentLink4URL: https://datasheet.ciiva.com/22747/1018594-22747513.pdf?src-supplier=Element14; ComponentLink4Description: https://datasheet.ciiva.com/22747/1018594-22747513.pdf?src-supplier=Element14; ComponentLink5URL: https://datasheet.ciiva.com/7849/1018594-7849869.pdf?src-supplier=Element14; ComponentLink5Description: https://datasheet.ciiva.com/7849/1018594-7849869.pdf?src-supplier=Element14; ComponentLink6URL: https://datasheet.ciiva.com/7983/1018594-7983502.pdf?src-supplier=Element14; ComponentLink6Description: https://datasheet.ciiva.com/7983/1018594-7983502.pdf?src-supplier=Element14; ComponentLink7URL: https://datasheet.ciiva.com/7849/1018594-7849871.pdf?src-supplier=Element14; ComponentLink7Description: https://datasheet.ciiva.com/7849/1018594-7849871.pdf?src-supplier=Element14; Supplier 1: Digi-Key; Stock 1: 60695854; Pricing 1: 1=0.10000, 10=0.01600, 100=0.00670, 1000=0.00301, 2500=0.00261, 5000=0.00215 (USD); Case/Package: 0402; Tolerance: 1%; Supplier Part Number 1: 311-1.00KLRCT-ND